# Altium project bdcmc-24.PrjPcb
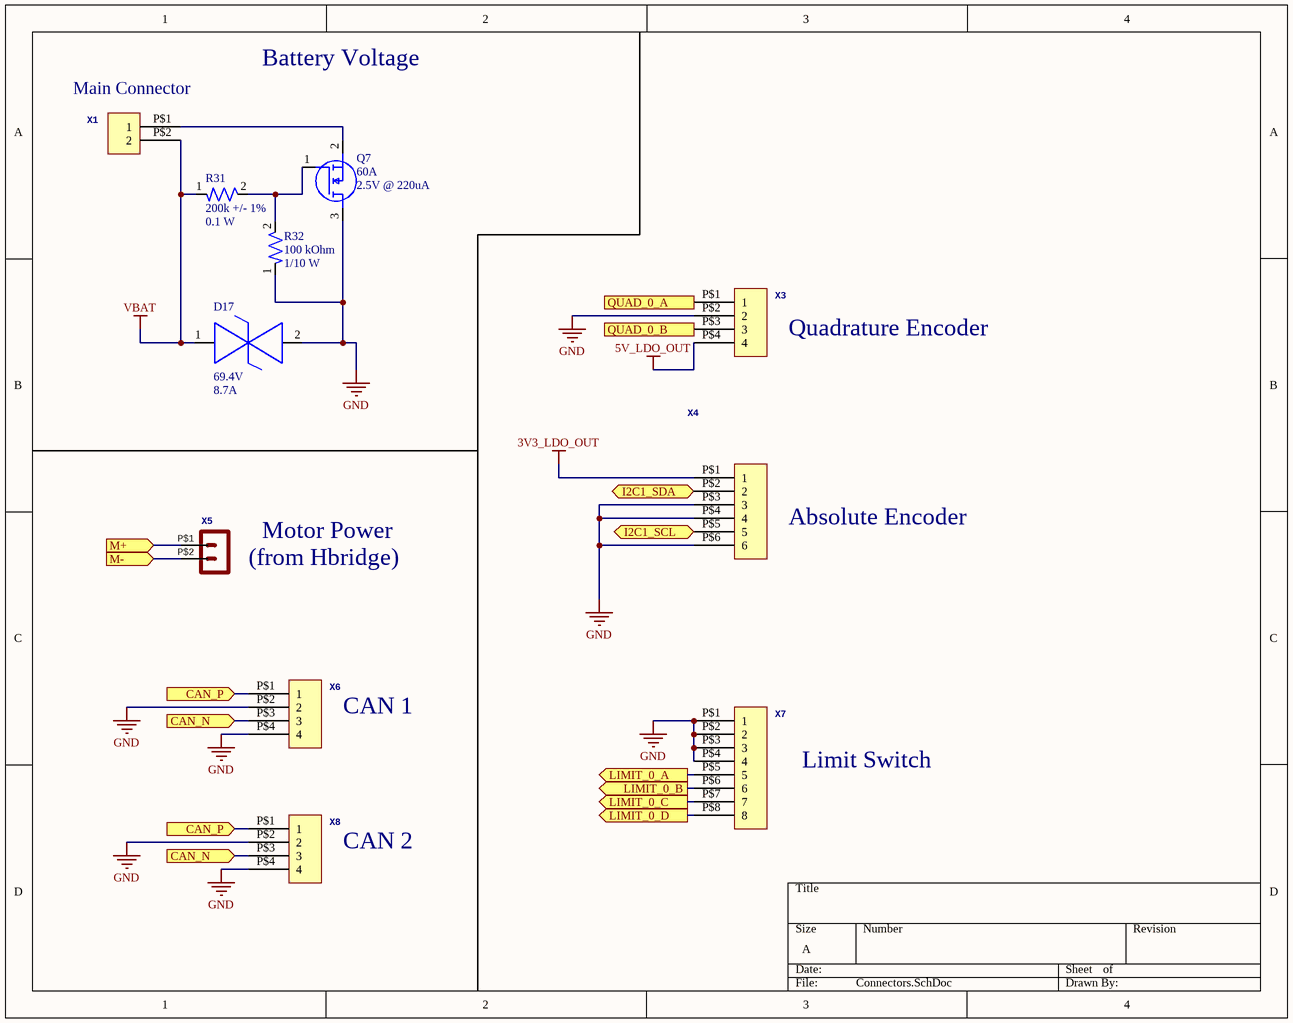
[diagram p0: Connectors.SchDoc]
5 sheets, 114 parts. Net scope: flat (ports and power ports of the same name join across sheets).
Board file: BDCMC_PCB.PcbDoc
Sheets:
  Connectors.SchDoc
  Motor_12V_Buck.SchDoc
  HBridge_Top_Level.SchDoc
  HBridge_Design.SchDoc
  MCU_CAN.SchDoc

## Sheet Connectors.SchDoc
size A; SheetNumber: 1; SheetTotal: 5

### Parts
D17  Vclamp: 69.4V  Peak pulser current: 8.7A  [DO-214AA (SMBJ)]  (hidden comment: SMBJE43CAH)
Q7  Drain Current: 60A  Vgs: 2.5V @ 220uA  [NMOS-8PowerVDFN]  (hidden comment: TPH7R006PL,L1Q)
R31  Resistance: 200k +/- 1%  Power Rating: 0.1 W  [RES-0603]  (hidden comment: ERJ-3EKF2003V)
R32  Resistance: 100 kOhm  Power: 1/10 W  [RES-0603]  (hidden comment: RC0603FR-07100KL)
X1  Molex 43650-0215  [43650-0215]  (value not drawn)
X3  Molex 43045-0412  [43045-0412]  (value not drawn)
X4  Molex 43045-0612  [43045-0612]  (value not drawn)
X5  Molex - Micro-Fit 3.0 Series connector,  3.00mm (0.118") pitch header, 2 positions.  [43045-0212]  (value not drawn)
X6  Molex 43045-0412  [43045-0412]  (value not drawn)
X7  Molex 43045-0812  [43045-0812]  (value not drawn)
X8  Molex 43045-0412  [43045-0412]  (value not drawn)

### Ports
CAN_N (in, see Connectors[1C], MCU_CAN[6B]), CAN_N (in, see Connectors[1D], MCU_CAN[6B]), CAN_P (in, see Connectors[1C], MCU_CAN[6A]), CAN_P (in, see Connectors[1D], MCU_CAN[6A]), I2C1_SCL (bidir, see MCU_CAN[3B]), I2C1_SDA (bidir, see MCU_CAN[3B]), LIMIT_0_A (out, see MCU_CAN[2C]), LIMIT_0_B (out, see MCU_CAN[2C]), LIMIT_0_C (out, see MCU_CAN[2C]), LIMIT_0_D (out, see MCU_CAN[2C]), M+ (in, see HBridge_Design[2B]), M- (in, see HBridge_Design[2B]), QUAD_0_A (out, see MCU_CAN[3B]), QUAD_0_B (out, see MCU_CAN[3B])

### Nets
3V3_LDO_OUT: X4.P$1(1)  [project net VBAT_MCU]
5V_LDO_OUT: X3.P$4(4)  [project net 5V]
GND: D17.2 Q7.3(D) R32.1 X3.P$2(2) X4.P$3(3) X4.P$4(4) X4.P$6(6) X6.P$2(2) X6.P$4(4) X7.P$1(1) X7.P$2(2) X7.P$3(3) X7.P$4(4) X8.P$2(2) X8.P$4(4)
VBAT: D17.1 R31.1 X1.P$2(2)
CAN_N: X6.P$3(3) X8.P$3(3) ; port CAN_N
CAN_P: X6.P$1(1) X8.P$1(1) ; port CAN_P
I2C1_SCL: X4.P$5(5) ; port I2C1_SCL
I2C1_SDA: X4.P$2(2) ; port I2C1_SDA
LIMIT_0_A: X7.P$5(5) ; port LIMIT_0_A
LIMIT_0_B: X7.P$6(6) ; port LIMIT_0_B
LIMIT_0_C: X7.P$7(7) ; port LIMIT_0_C
LIMIT_0_D: X7.P$8(8) ; port LIMIT_0_D
M+: X5.P$1 ; port M+
M-: X5.P$2 ; port M-
QUAD_0_A: X3.P$1(1) ; port QUAD_0_A
QUAD_0_B: X3.P$3(3) ; port QUAD_0_B
NetQ7_1: Q7.1(G) R31.2 R32.2
NetQ7_2: Q7.2(S) X1.P$1(1)

### Notes on the sheet
- (near X1) Main Connector
- Battery Voltage
- Quadrature Encoder
- (near X5) (from Hbridge)
- Motor Power
- Absolute Encoder
- CAN 1
- Limit Switch
- CAN 2

### Library data of the parts
D17 = DIO-69.4V-0001: 69.4V Clamp 8.7A Ipp Tvs Diode Surface Mount DO-214AA (SMBJ); Channels: Bidirectional; Breakdown VOltage: 47.8V; Reverse working maximum voltage: 43V; Package: DO-214AA (SMBJ)
Q7 = NMOS-60A-0001: N-Channel 60 V 60A (Tc) 81W (Tc) Surface Mount 8-SOP Advance (5x5); Vdss: 60V; Vgs(Max): 20V; Package: 8-PowerVDFN
R31 = RES-200K-0001: 200 kOhms ±1% 0.1W, 1/10W Chip Resistor 0603 (1608 Metric) Automotive AEC-Q200 Thick Film; Manufacturer: Panasonic Electronic Components; Assembled?: Yes; MFP: ERJ-3EKF2003V; Package SIze: 0603
R32 = RES-100K-0003: 100 kOhms ±1% 0.1W, 1/10W Chip Resistor 0603 (1608 Metric) Moisture Resistant Thick Film; Tolerance: +/- 1%; Assembled?: No; Package Size: 0603
X1 = Micro-Fit Molex 2 Pin Vertical: GateName_1: G$1; SymbolName_1: HEADER_POS2; DeviceSetName: HEADER_POS2_?; DeviceName: 43650-0215; LibraryName: con-molex-micro-fit-3_0_2; Package: 43650-0215
X3 X6 X8 = Micro-Fit Molex 4 Pin 2 Row Vertical: GateName_1: G$1; SymbolName_1: HEADER_POS4; DeviceSetName: HEADER_POS4_?; DeviceName: 43045-0412; LibraryName: con-molex-micro-fit-3_0_2; Package: 43045-0412
X4 = Micro-Fit Molex 6 Pin 2 Row Vertical: GateName_1: G$1; SymbolName_1: HEADER_POS6; DeviceSetName: HEADER_POS6_?; DeviceName: 43045-0612; LibraryName: con-molex-micro-fit-3_0_2; Package: 43045-0612
X5 = HEADER_POS2_?43045-0212: GateName_1: G$1; SymbolName_1: HEADER_POS2; DeviceName: 43045-0212; LibraryName: con-molex-micro-fit-3_0_2; DeviceSetName: HEADER_POS2_?; Package: 43045-0212
X7 = Micro-Fit Molex 8 Pin 2 Row Vertical: GateName_1: G$1; SymbolName_1: HEADER_POS8; DeviceSetName: HEADER_POS8_?; DeviceName: 43045-0812; LibraryName: con-molex-micro-fit-3_0_2; Package: 43045-0812

## Sheet Motor_12V_Buck.SchDoc
size A; SheetNumber: 2; SheetTotal: 5
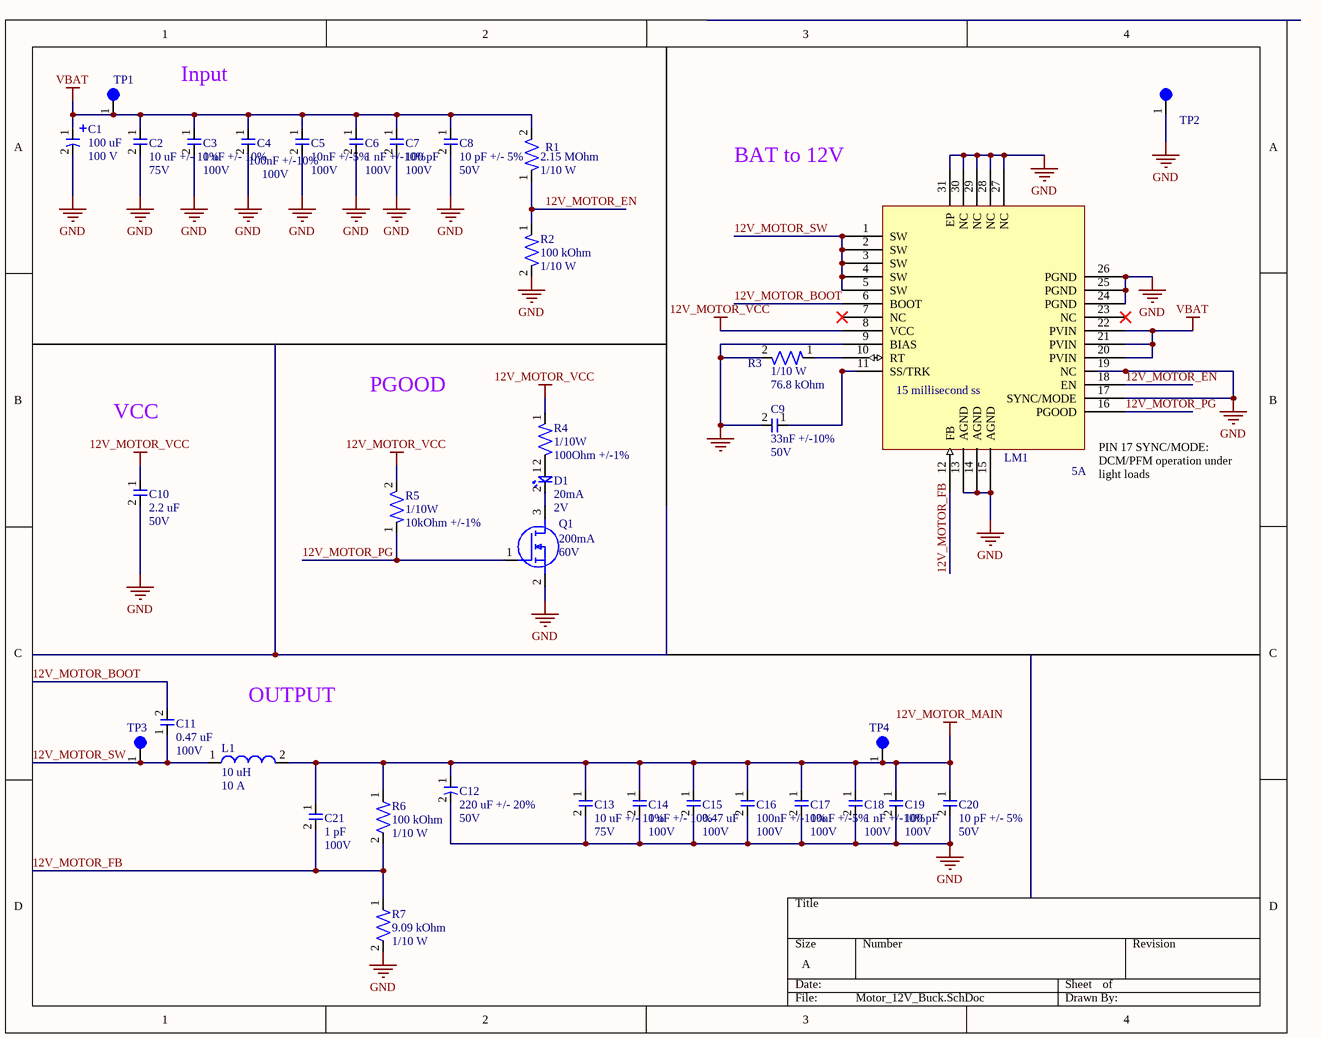
[diagram p1: Motor_12V_Buck.SchDoc]

### Parts
C1  Capacitance: 100 uF  Voltage: 100 V  [ELEC-100U-0001]  (hidden comment: 100SEV100M12.5X16)
C2  Capacitance: 10 uF +/- 10%  Voltage Rating: 75V  [CAP-1210]  (hidden comment: C3225X7R1N106K250AC)
C3  Capacitance: 1 uF +/- 10%  Voltage: 100V  [CAP-1206 - duplicate]  (hidden comment: CL31B105KCHNNNE)
C4  Capacitance: 100nF +/-10%  Voltage Rating: 100V  [CAP-0603]  (hidden comment: CC0603KRX7R0BB104)
C5  Capacitance: 10nF +/-5%  Voltage Rating: 100V  [CAP-0603]  (hidden comment: C1608C0G2A103J080AC)
C6  Capacitance: 1 nF +/-10%  Voltage: 100V  [CAP-0603]  (hidden comment: C0603Y102K1RAC7867)
C7  Capacitance: 100 pF  Voltage: 100V  [CAP-0603]  (hidden comment: 0603N101J101CT)
C8  Capacitance: 10 pF +/- 5%  Voltage Rating: 50V  [CAP-0603]  (hidden comment: 0603N100J500CT)
C9  Capacitance: 33nF +/-10%  Voltage Rating: 50V  [CAP-0603]  (hidden comment: CC0603KRX7R9BB333)
C10  Capacitance: 2.2 uF  oltage: 50V  [CAP-0603]  (hidden comment: UMK107BBJ225KA-T)
C11  Capacitance: 0.47 uF  Voltage: 100V  [CAP-0805]  (hidden comment: KAM21KR72A474KL)
C12  Capacitance: 220 uF +/- 20%  Voltage Rating: 50V  [ELEC-220U-0003]  (hidden comment: 50TZV220M10X10.5)
C13  Capacitance: 10 uF +/- 10%  Voltage Rating: 75V  [CAP-1210]  (hidden comment: C3225X7R1N106K250AC)
C14  Capacitance: 1 uF +/- 10%  Voltage: 100V  [CAP-1206 - duplicate]  (hidden comment: CL31B105KCHNNNE)
C15  Capacitance: 0.47 uF  Voltage: 100V  [CAP-0805]  (hidden comment: KAM21KR72A474KL)
C16  Capacitance: 100nF +/-10%  Voltage Rating: 100V  [CAP-0603]  (hidden comment: CC0603KRX7R0BB104)
C17  Capacitance: 10nF +/-5%  Voltage Rating: 100V  [CAP-0603]  (hidden comment: C1608C0G2A103J080AC)
C18  Capacitance: 1 nF +/-10%  Voltage: 100V  [CAP-0603]  (hidden comment: C0603Y102K1RAC7867)
C19  Capacitance: 100 pF  Voltage: 100V  [CAP-0603]  (hidden comment: 0603N101J101CT)
C20  Capacitance: 10 pF +/- 5%  Voltage Rating: 50V  [CAP-0603]  (hidden comment: 0603N100J500CT)
C21  Capacitance: 1 pF  Voltage: 100V  [CAP-0603]  (hidden comment: 885012006087)
D1  Current Rating: 20mA  Vf: 2V  [LED-0603]  (hidden comment: 150060AS75000)
L1  Inductance: 10 uH  DCI: 10 A  [PWRIND-10U-0002]  (hidden comment: SRP1270-100M)
LM1  Current: 5A  [IC-30-WQFN(6x4)]  (hidden comment: LM76005RNPR)
Q1  Id-Continuous: 200mA  VDS-Max: 60V  [NMOS-SOT23-3]  (hidden comment: T2N7002AK,LM)
R1  Resistance: 2.15 MOhm  Power: 1/10 W  [RES-0603]  (hidden comment: RC0603FR-072M15L)
R2  Resistance: 100 kOhm  Power: 1/10 W  [RES-0603]  (hidden comment: RC0603FR-07100KL)
R3  Power: 1/10 W  Resistance: 76.8 kOhm  [RES-0603]  (hidden comment: RC0603FR-0776K8L)
R4  Power Rating: 1/10W  Resistance: 100Ohm +/-1%  [RES-0603]  (hidden comment: AC0603FR-10100RL)
R5  Power Rating: 1/10W  Resistance: 10kOhm +/-1%  [RES-0603]  (hidden comment: RC0603FR-0710KP)
R6  Resistance: 100 kOhm  Power: 1/10 W  [RES-0603]  (hidden comment: RC0603FR-07100KL)
R7  Resistance: 9.09 kOhm  Power: 1/10 W  [RES-0603]  (hidden comment: RC0603FR-079K09L)
TP1  5003  [TEST-POINT-0001]  (value not drawn)
TP2  5003  [TEST-POINT-0001]  (value not drawn)
TP3  5003  [TEST-POINT-0001]  (value not drawn)
TP4  5003  [TEST-POINT-0001]  (value not drawn)

### Nets
12V_MOTOR_MAIN: C12.1 C13.1 C14.1 C15.1 C16.1 C17.1 C18.1 C19.1 C20.1 C21.1 L1.2 R6.1 TP4.1
12V_MOTOR_VCC: C10.1 LM1.8(VCC) R4.1 R5.2
GND: C1.2 C2.2 C3.2 C4.2 C5.2 C6.2 C7.2 C8.2 C10.2 C12.2 C13.2 C14.2 C15.2 C16.2 C17.2 C18.2 C19.2 C20.2 LM1.13(AGND) LM1.14(AGND) LM1.15(AGND) LM1.17(SYNC/MODE) LM1.19(NC) LM1.24(PGND) LM1.25(PGND) LM1.26(PGND) LM1.27(NC) LM1.28(NC) LM1.29(NC) LM1.30(NC) LM1.31(EP) Q1.2(S) R2.2 R7.2 TP2.1
NetC9_2: C9.2 LM1.9(BIAS) R3.2
VBAT: C1.1 C2.1 C3.1 C4.1 C5.1 C6.1 C7.1 C8.1 LM1.20(PVIN) LM1.21(PVIN) LM1.22(PVIN) R1.2 TP1.1
12V_MOTOR_BOOT: C11.2 LM1.6(BOOT)
12V_MOTOR_EN: LM1.18(EN) R1.1 R2.1
12V_MOTOR_FB: C21.2 LM1.12(FB) R6.2 R7.1
12V_MOTOR_PG: LM1.16(PGOOD) Q1.1(G) R5.1
12V_MOTOR_SW: C11.1 L1.1 LM1.1(SW) LM1.2(SW) LM1.3(SW) LM1.4(SW) LM1.5(SW) TP3.1
NetC9_1: C9.1 LM1.11(SS/TRK)
NetD1_1: D1.1 R4.2
NetD1_2: D1.2 Q1.3(D)
NetLM1_10: LM1.10(RT) R3.1

Not connected (* = marked no-connect by the designer): LM1 7(NC)* 23(NC)*

### Notes on the sheet
- Input
- (near LM1) BAT to 12V
- VCC
- PGOOD
- (near LM1) 15 millisecond ss
- (near LM1) PIN 17 SYNC/MODE: DCM/PFM operation under light loads
- OUTPUT

### Library data of the parts
C1 = ELEC-100U-0001: 100 µF 100 V Aluminum Electrolytic Capacitors Radial, Can - SMD 2000 Hrs @ 85°C; Manufacturer: Rubycon; Tolerance: +/- 20%; Assembled?: No; ESR: idk check the datasheet i couldnt find it
C2 C13 = CAP-10U-0004: 10 µF ±10% 75V Ceramic Capacitor X7R 1210 (3225 Metric)
C3 C14 = CAP-1U-0001: 1 µF ±10% 100V Ceramic Capacitor X7R 1206 (3216 Metric)
C4 C16 = CAP-100N-0001: CAP CER 0.1UF 100V X7R 0603; Manufacturer: YAGEO; Assembled?: no; Manufacturer Part Number: CC0603KRX7R0BB104; Temperature Coefficient: X7R; Package Size: 0603
C5 C17 = CAP-10N-0002: CAP CER 10000PF 100V C0G 0603; Manufacturer: TDK Corporation; Temperature Coefficient: C0G/NP0; Assembled?: no; Manufacturer Part Number: C1608C0G2A103J080AC; Package Size: 0603
C6 C18 = CAP-1N-0001: 1000 pF ±10% 100V Ceramic Capacitor X7R 0603 (1608 Metric)
C7 C19 = CAP-100P-0002: 100 pF ±5% 100V Ceramic Capacitor C0G, NP0 0603 (1608 Metric); Tolerance: +/-5%; Temp Coeff: C0G/NP0; Package Size: 0603
C8 C20 = CAP-10P-0001: 10 pF ±5% 50V Ceramic Capacitor C0G, NP0 0603 (1608 Metric); Manufacturer: Walshin Technology Corporation; Assembled?: Yes; Manufacturer Part Number: 0603N100J500CT; Temperature Coefficient: C0G, NP0; Package Size: 0603
C9 = CAP-33N-0001: 0.033 µF ±10% 50V Ceramic Capacitor X7R 0603 (1608 Metric); Manufacturer: YAGEO; Assembled?: no; Manufacturer Part Number: CC0603KRX7R9BB333; Temperature Coefficient: X7R; Package Size: 0603
C10 = CAP-2.2U-0001: 2.2 µF ±10% 50V Ceramic Capacitor X5R 0603 (1608 Metric)
C11 C15 = CAP-0.47U-0001: 0.47 µF ±10% 100V Ceramic Capacitor X7R 0805 (2012 Metric); Tolerance: +/- 10%; Assembled?: No; Temperature Coefficient: X7R; Package Size: 0805
C12 = ELEC-220U-0003: 220 µF 50 V Aluminum Electrolytic Capacitors Radial, Can - SMD 2000 Hrs @ 105°C; Size: .406inx.406in*.413in
C21 = CAP-1P-0001: 1 pF ±0.25pF 100V Ceramic Capacitor C0G, NP0 0603 (1608 Metric); Tolerance: +/- 0.25 pF; Temperature Coefficient: C0G/NP0; Assembled?: No; Package Size: 0603
D1 = LED_Amber_0001: CAP CER 0.1UF 100V X7R 0603; Manufacturer: Wurth Electronik; Assembled?: no; Color: Amber; Manufacturer Part Number: 150060AS75000; Package Size: 0603
L1 = PWRIND-10U-0002: 10 µH Shielded Drum Core, Wirewound Inductor 10 A 16.8mOhm Max Nonstandard; Tolerance: +/- 20%; Isat: 16A; Assembled?: No; DCR: 16.8 mOhm
LM1 = IC-BUCK-0006: Buck Switching Regulator IC Positive Adjustable 1V 1 Output 5A 30-WFQFN Exposed Pad; Manufacturer: Texas Instruments; Assembled?: no; Manufacturer Part Number: LM76005RNPR; Type: Buck; Package: 30-WFQFN
Q1 = NMOS-200MA-0001: MOSFET N-CH 60V 200MA SOT23; Manufacturer: Toshiba; FET type: N-Channel; Rds On-Max: 3.9Ohm; Vgs-Max: 20V; Assembled?: no; Manufacturer Part Number: T2N7002AK,LM; Package: SOT-23-3
R1 = RES-2.15M-0001: 2.15 MOhms ±1% 0.1W, 1/10W Chip Resistor 0603 (1608 Metric) Moisture Resistant Thick Film; Tolerance: +/-1%; Assembled?: No; Package Size: 0603
R2 R6 = RES-100K-0003: as R32 on sheet Connectors; Package Size: 0603
R3 = RES-76.8K-0001: 76.8 kOhms ±1% 0.1W, 1/10W Chip Resistor 0603 (1608 Metric) Moisture Resistant Thick Film; Manufacturer: Yageo; Tolerance: +/- 1%; Package Size: 0603
R4 = RES-100-0002: 100 Ohms ±1% 0.1W, 1/10W Chip Resistor 0603 (1608 Metric) Automotive AEC-Q200 Thick Film; Manufacturer: YAGEO; Assembled?: no; Manufacturer Part Number: AC0603FR-10100RL; Package Size: 0603
R5 = RES-10K-0002: RES SMD 10K OHM 1% 1/10W 0603; Manufacturer: YAGEO; Assembled?: no; Manufacturer Part Number: RC0603FR-0710KP; Package Size: 0603
R7 = RES-9.09K-0001: 9.09 kOhms ±1% 0.1W, 1/10W Chip Resistor 0603 (1608 Metric) Moisture Resistant Thick Film; Tolerance: +/-1%; Assembled?: No; Package Size: 0603
TP1-TP4 = TEST-POINT-0001: Oranange PC Test Point, Miniature Phoisphor Bronze Silver Plating Through Hole Mounting Type

## Sheet HBridge_Top_Level.SchDoc
size 203 x 127 mm; SheetNumber: 4; SheetTotal: 6
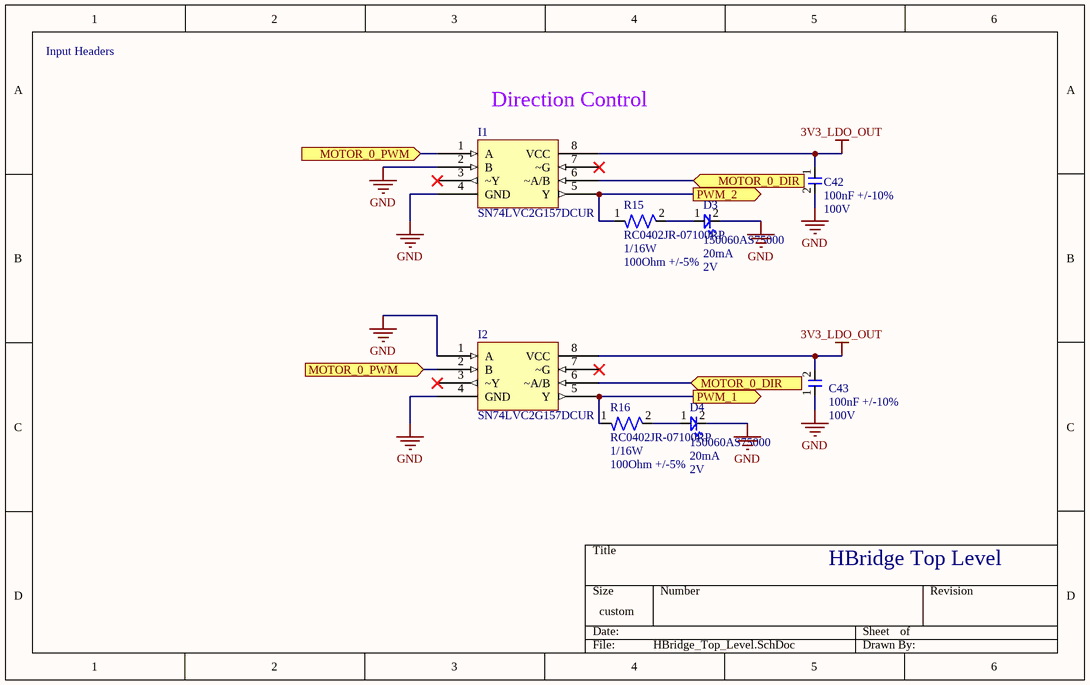
[diagram p2: HBridge_Top_Level.SchDoc]

### Parts
C42  Capacitance: 100nF +/-10%  Voltage Rating: 100V  [CAP-0603]  (hidden comment: CC0603KRX7R0BB104)
C43  Capacitance: 100nF +/-10%  Voltage Rating: 100V  [CAP-0603]  (hidden comment: CC0603KRX7R0BB104)
D3  150060AS75000  Current Rating: 20mA  Vf: 2V  [LED-0603]
D4  150060AS75000  Current Rating: 20mA  Vf: 2V  [LED-0603]
I1  SN74LVC2G157DCUR  [IC-MUX-8VSSOP]
I2  SN74LVC2G157DCUR  [IC-MUX-8VSSOP]
R15  RC0402JR-07100RP  Power Rating: 1/16W  Resistance: 100Ohm +/-5%  [RES-0402]
R16  RC0402JR-07100RP  Power Rating: 1/16W  Resistance: 100Ohm +/-5%  [RES-0402]

### Ports
MOTOR_0_DIR (in, see HBridge_Top_Level[4B], MCU_CAN[4C]), MOTOR_0_DIR (in, see HBridge_Top_Level[4C], MCU_CAN[4C]), MOTOR_0_PWM (in, see HBridge_Top_Level[2A], MCU_CAN[4C]), MOTOR_0_PWM (in, see HBridge_Top_Level[2C], MCU_CAN[4C]), PWM_1 (out, see HBridge_Design[1D]), PWM_2 (out, see HBridge_Design[1D])

### Nets
3V3_LDO_OUT: C42.1 C43.2 I1.8(VCC) I2.8(VCC)  [project net VBAT_MCU]
GND: C42.2 C43.1 D3.2 D4.2 I1.2(B) I1.4(GND) I2.1(A) I2.4(GND)
DIR_1_In: I2.5(Y) R16.1 ; port PWM_1
DIR_2_In: I1.5(Y) R15.1 ; port PWM_2
MOTOR_0_DIR: I1.6(~A/B) I2.6(~A/B) ; port MOTOR_0_DIR
MOTOR_0_PWM: I1.1(A) I2.2(B) ; port MOTOR_0_PWM
NetD3_1: D3.1 R15.2
NetD4_1: D4.1 R16.2

Not connected (* = marked no-connect by the designer): I1 3(~Y)* 7(~G)*; I2 3(~Y)* 7(~G)*

### Notes on the sheet
- Input Headers
- (near I1) Direction Control
- HBridge Top Level

### Library data of the parts
C42 C43 = CAP-100N-0001: as C4 on sheet Motor_12V_Buck; Manufacturer Part Number: CC0603KRX7R0BB104; Temperature Coefficient: X7R; Package Size: 0603
D3 D4 = LED_Amber_0001: as D1 on sheet Motor_12V_Buck; Manufacturer Part Number: 150060AS75000; Package Size: 0603
I1 = IC-MUX-0001
I2 = IC-MUX-0001: Multiplexer 1 x 2:1 8-VSSOP; Vin: 1.65-5.5V
R15 R16 = RES-100-0001: RES SMD 100 OHM 5% 1/16W 0402; Manufacturer: YAGEO; Assembled?: no; Manufacturer Part Number: RC0402JR-07100RP; Package Size: 0402

## Sheet HBridge_Design.SchDoc
size Letter; SheetNumber: 4; SheetTotal: 5
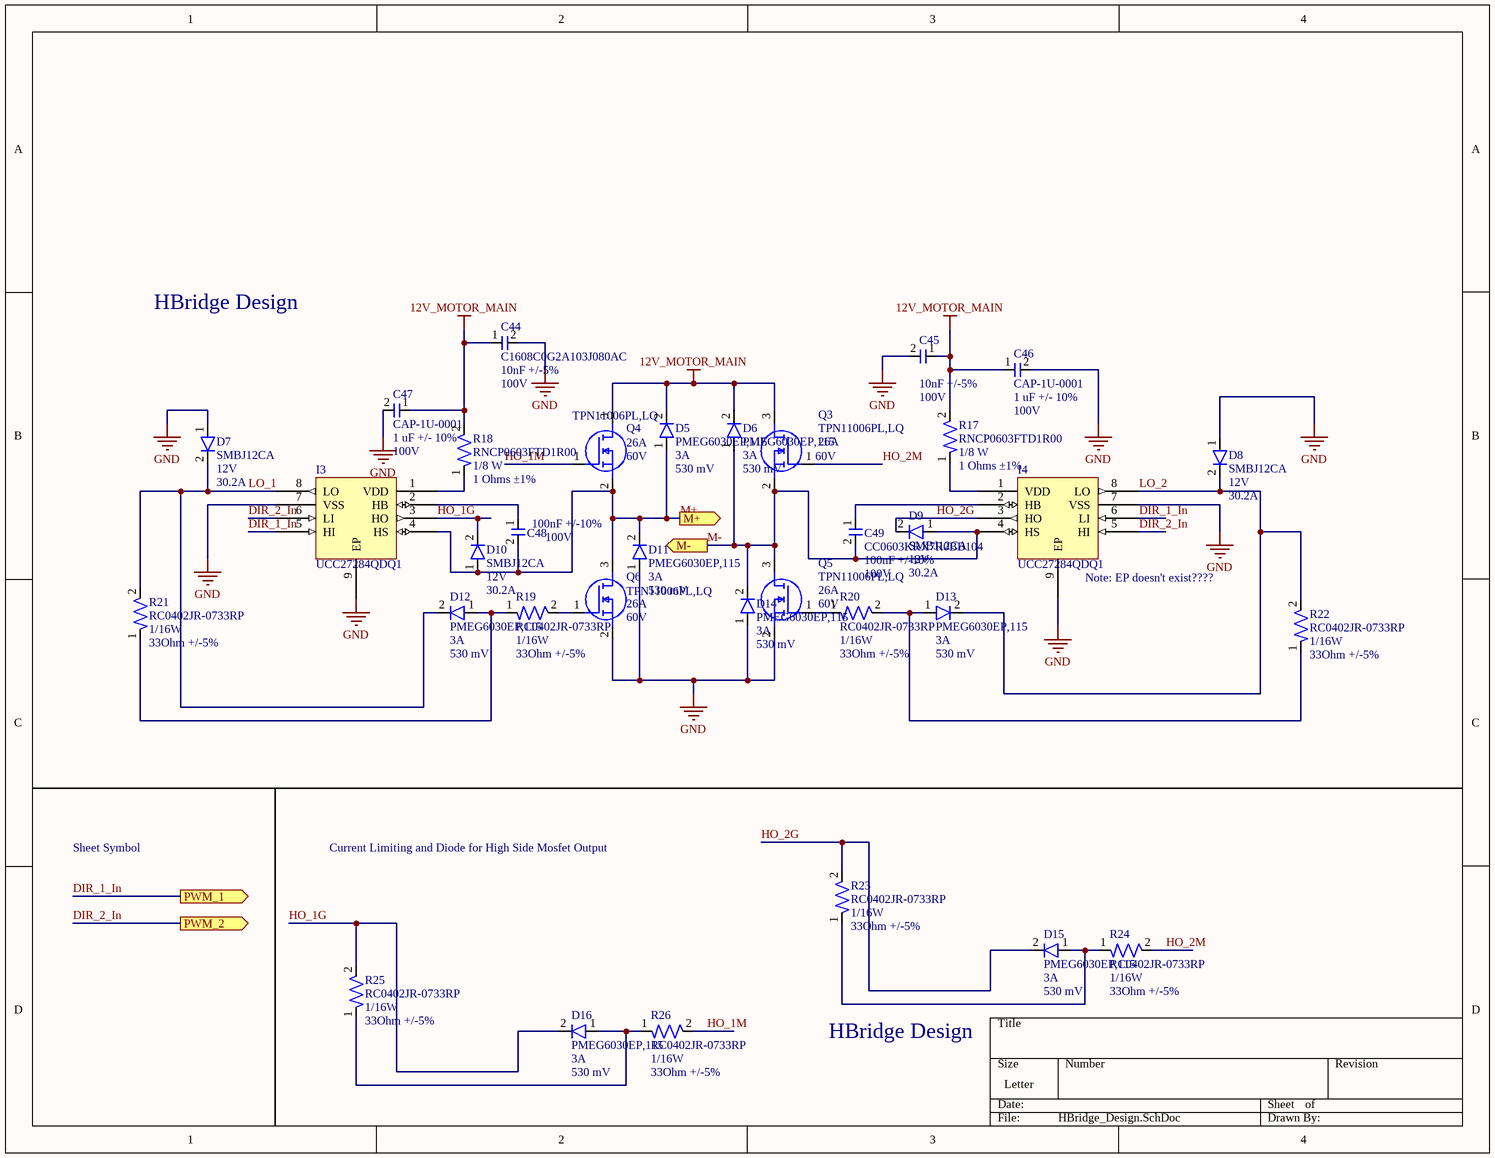
[diagram p3: HBridge_Design.SchDoc]

### Parts
C44  C1608C0G2A103J080AC  Capacitance: 10nF +/-5%  Voltage Rating: 100V  [CAP-0603]
C45  Capacitance: 10nF +/-5%  Voltage Rating: 100V  [CAP-0603]  (hidden comment: C1608C0G2A103J080AC)
C46  CAP-1U-0001  Capacitance: 1 uF +/- 10%  Voltage: 100V  [CAP-1206 - duplicate]
C47  CAP-1U-0001  Capacitance: 1 uF +/- 10%  Voltage: 100V  [CAP-1206 - duplicate]
C48  Capacitance: 100nF +/-10%  Voltage Rating: 100V  [CAP-0603]  (hidden comment: CC0603KRX7R0BB104)
C49  CC0603KRX7R0BB104  Capacitance: 100nF +/-10%  Voltage Rating: 100V  [CAP-0603]
D5  PMEG6030EP,115  Current Rating: 3A  Vf (Voltage Forward): 530 mV  [DIO-SOD128]
D6  PMEG6030EP,115  Current Rating: 3A  Vf (Voltage Forward): 530 mV  [DIO-SOD128]
D7  SMBJ12CA  Standoff Voltage: 12V  Current Rating: 30.2A  [DO-214AA (SMBJ)]
D8  SMBJ12CA  Standoff Voltage: 12V  Current Rating: 30.2A  [DO-214AA (SMBJ)]
D9  SMBJ12CA  Standoff Voltage: 12V  Current Rating: 30.2A  [DO-214AA (SMBJ)]
D10  SMBJ12CA  Standoff Voltage: 12V  Current Rating: 30.2A  [DO-214AA (SMBJ)]
D11  PMEG6030EP,115  Current Rating: 3A  Vf (Voltage Forward): 530 mV  [DIO-SOD128]
D12  PMEG6030EP,115  Current Rating: 3A  Vf (Voltage Forward): 530 mV  [DIO-SOD128]
D13  PMEG6030EP,115  Current Rating: 3A  Vf (Voltage Forward): 530 mV  [DIO-SOD128]
D14  PMEG6030EP,115  Current Rating: 3A  Vf (Voltage Forward): 530 mV  [DIO-SOD128]
D15  PMEG6030EP,115  Current Rating: 3A  Vf (Voltage Forward): 530 mV  [DIO-SOD128]
D16  PMEG6030EP,115  Current Rating: 3A  Vf (Voltage Forward): 530 mV  [DIO-SOD128]
I3  UCC27284QDQ1  [IC-BUCK-8SOIC]
I4  UCC27284QDQ1  [IC-BUCK-8SOIC]
Q3  TPN11006PL,LQ  Id-Continuous: 26A  VDS-Max: 60V  [NMOS-8TSON]
Q4  TPN11006PL,LQ  Id-Continuous: 26A  VDS-Max: 60V  [NMOS-8TSON]
Q5  TPN11006PL,LQ  Id-Continuous: 26A  VDS-Max: 60V  [NMOS-8TSON]
Q6  TPN11006PL,LQ  Id-Continuous: 26A  VDS-Max: 60V  [NMOS-8TSON]
R17  RNCP0603FTD1R00  Power: 1/8 W  Resistance: 1 Ohms ±1%  [RES-0603]
R18  RNCP0603FTD1R00  Power: 1/8 W  Resistance: 1 Ohms ±1%  [RES-0603]
R19  RC0402JR-0733RP  Power Rating: 1/16W  Resistance: 33Ohm +/-5%  [RES-0402]
R20  RC0402JR-0733RP  Power Rating: 1/16W  Resistance: 33Ohm +/-5%  [RES-0402]
R21  RC0402JR-0733RP  Power Rating: 1/16W  Resistance: 33Ohm +/-5%  [RES-0402]
R22  RC0402JR-0733RP  Power Rating: 1/16W  Resistance: 33Ohm +/-5%  [RES-0402]
R23  RC0402JR-0733RP  Power Rating: 1/16W  Resistance: 33Ohm +/-5%  [RES-0402]
R24  RC0402JR-0733RP  Power Rating: 1/16W  Resistance: 33Ohm +/-5%  [RES-0402]
R25  RC0402JR-0733RP  Power Rating: 1/16W  Resistance: 33Ohm +/-5%  [RES-0402]
R26  RC0402JR-0733RP  Power Rating: 1/16W  Resistance: 33Ohm +/-5%  [RES-0402]

### Ports
M+ (out, see Connectors[1C]), M- (out, see Connectors[1C]), PWM_1 (out, see HBridge_Top_Level[4C]), PWM_2 (out, see HBridge_Top_Level[4B])

### Nets
12V_MOTOR_MAIN: C44.1 C45.1 C46.1 C47.1 D5.2 D6.2 Q3.3(D) Q4.3(D) R17.2 R18.2
GND: C44.2 C45.2 C46.2 C47.2 D7.1 D8.1 D11.1 D14.1 I3.7(VSS) I3.9(EP) I4.7(VSS) I4.9(EP) Q5.2(S) Q6.2(S)
DIR_1_In: I3.5(HI) I4.6(LI) ; port PWM_1
DIR_2_In: I3.6(LI) I4.5(HI) ; port PWM_2
HO_1G: D10.2 D16.2 I3.3(HO) R25.2
HO_1M: Q4.1(G) R26.2
HO_2G: D9.2 D15.2 I4.3(HO) R23.2
HO_2M: Q3.1(G) R24.2
LO_1: D7.2 D12.2 I3.8(LO) R21.2
LO_2: D8.2 D13.2 I4.8(LO) R22.2
M+: C48.2 D5.1 D10.1 D11.2 I3.4(HS) Q4.2(S) Q6.3(D) ; port M+
M-: C49.2 D6.1 D9.1 D14.2 I4.4(HS) Q3.2(S) Q5.3(D) ; port M-
NetC48_1: C48.1 I3.2(HB)
NetC49_1: C49.1 I4.2(HB)
NetD12_1: D12.1 R19.1 R21.1
NetD13_1: D13.1 R20.2 R22.1
NetD15_1: D15.1 R23.1 R24.1
NetD16_1: D16.1 R25.1 R26.1
NetI3_1: I3.1(VDD) R18.1
NetI4_1: I4.1(VDD) R17.1
NetQ5_1: Q5.1(G) R20.1
NetQ6_1: Q6.1(G) R19.2

### Notes on the sheet
- HBridge Design
- (near I4) Note: EP doesn't exist????
- Sheet Symbol
- Current Limiting and Diode for High Side Mosfet Output

### Library data of the parts
C44 C45 = CAP-10N-0002: as C5 on sheet Motor_12V_Buck; Manufacturer Part Number: C1608C0G2A103J080AC; Package Size: 0603
C46 C47 = CAP-1U-0001: as C3 on sheet Motor_12V_Buck
C48 C49 = CAP-100N-0001: as C4 on sheet Motor_12V_Buck; Manufacturer Part Number: CC0603KRX7R0BB104; Temperature Coefficient: X7R; Package Size: 0603
D5 D6 D11-D16 = DIO-0.53V-0001: Diode Schottky 60 V 3A Surface Mount SOD-128/CFP5; Manufacturer: Nexperia USA Inc.; Assembled: no; Manufacturer Part Number: PMEG6030EP,115; Package: SOD-128/CFP5
D7-D10 = DIO-19.9V-0001: 19.9V Clamp 30.2A Ipp Tvs Diode Surface Mount DO-214AA (SMBJ); Manufacturer: Littlefuse Inc.; Assembled: No; Breakdown Voltage: 13.3; Manufacturer Part Number: SMBJ12CA; Package: DO-214AA (SMBJ)
I3 I4 = IC-GDRV-0001: Gate Drivers Automotive 3-A, 120-V half bridge gate driver with 5-V UVLO and enable 8-SOIC -40 to 125; Manufacturer: Texas Instruments; Assembled?: no; VCC-Max: 16V; VCC-Min: 5.5V; Load Voltage-Max: 120V; Supply Current: 3A; Manufacturer Part Number: UCC27284QDQ1; Package: SOIC-8
Q3-Q6 = NMOS-26A-0001: MOSFET N-CH 60V 200MA SOT23; Manufacturer: Toshiba; FET type: N-Channel; Rds On-Max: 18.1mOhm; Vgs-Max: 20V; Assembled?: no; Manufacturer Part Number: TPN11006PL,LQ; Package: 8-TSON Advance
R17 R18 = RES-1-0001: 1 Ohms ±1% 0.125W, 1/8W Chip Resistor 0603 (1608 Metric) Anti-Sulfur Thin Film
R19-R26 = RES-33-0001: RES SMD 33 OHM 5% 1/16W 0402; Manufacturer: YAGEO; Assembled?: no; Manufacturer Part Number: RC0402JR-0733RP; Package Size: 0402

## Sheet MCU_CAN.SchDoc
size B; SheetNumber: 5; SheetTotal: 5
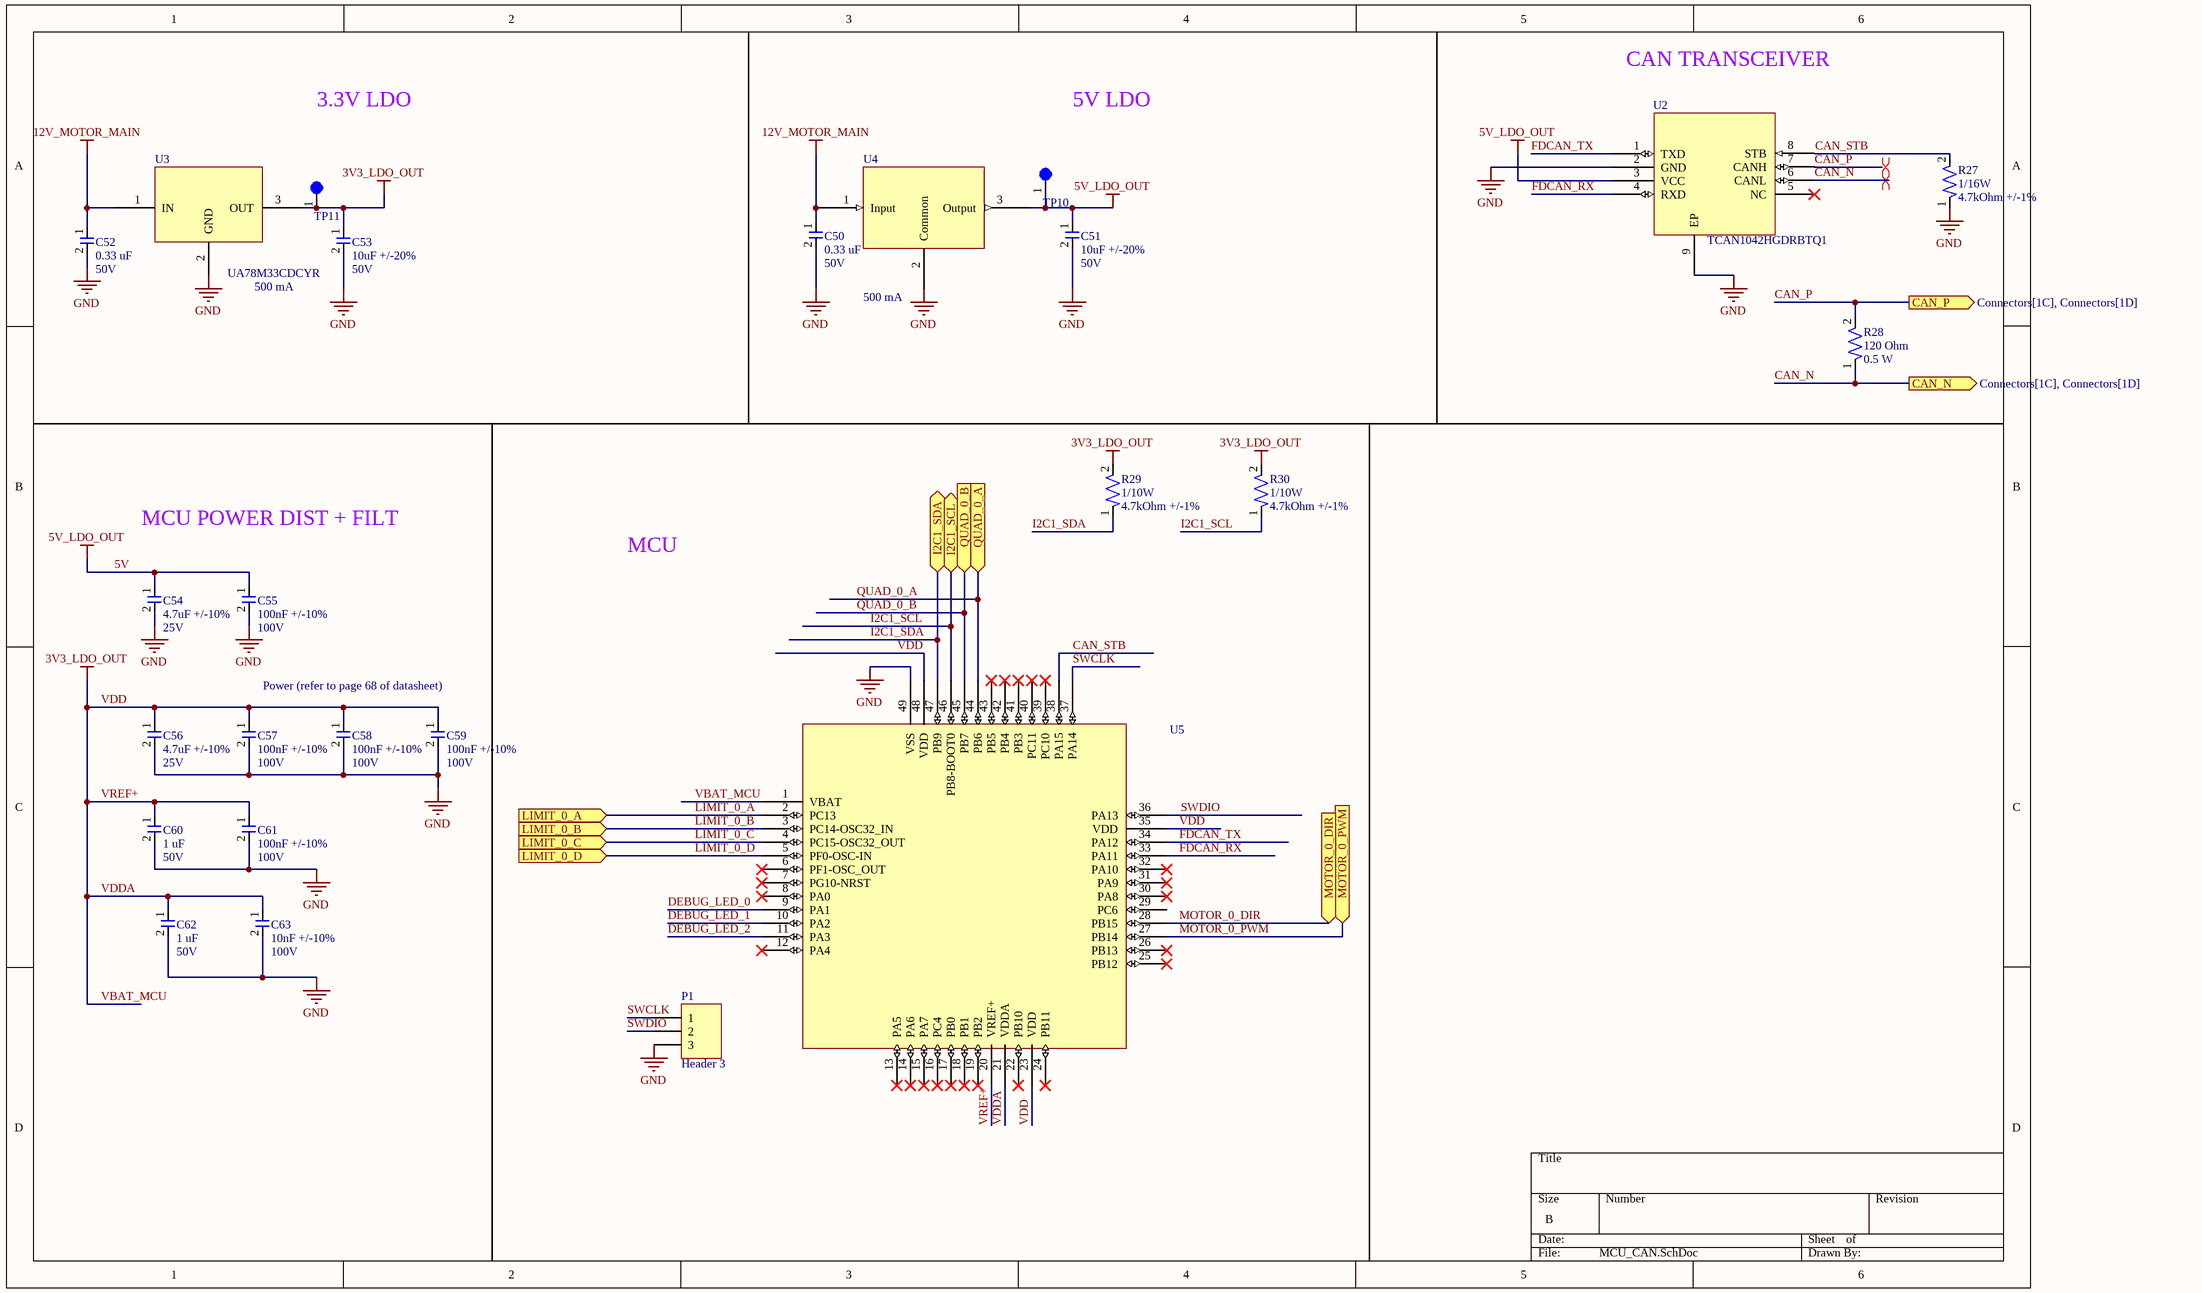
[diagram p4: MCU_CAN.SchDoc]

### Parts
C50  Capacitance: 0.33 uF  Voltage: 50V  [CAP-0603]  (hidden comment: CGA3E3X7R1H334K080AB)
C51  Capacitance: 10uF +/-20%  Voltage Rating: 50V  [CAP-1206]  (hidden comment: CL31B106KBHNNNE)
C52  Capacitance: 0.33 uF  Voltage: 50V  [CAP-0603]  (hidden comment: CGA3E3X7R1H334K080AB)
C53  Capacitance: 10uF +/-20%  Voltage Rating: 50V  [CAP-1206]  (hidden comment: CL31B106KBHNNNE)
C54  Capacitance: 4.7uF +/-10%  Voltage Rating: 25V  [CAP-0603]  (hidden comment: TMK107BBJ475KA-T)
C55  Capacitance: 100nF +/-10%  Voltage Rating: 100V  [CAP-0603]  (hidden comment: CC0603KRX7R0BB104)
C56  Capacitance: 4.7uF +/-10%  Voltage Rating: 25V  [CAP-0603]  (hidden comment: TMK107BBJ475KA-T)
C57  Capacitance: 100nF +/-10%  Voltage Rating: 100V  [CAP-0603]  (hidden comment: CC0603KRX7R0BB104)
C58  Capacitance: 100nF +/-10%  Voltage Rating: 100V  [CAP-0603]  (hidden comment: CC0603KRX7R0BB104)
C59  Capacitance: 100nF +/-10%  Voltage Rating: 100V  [CAP-0603]  (hidden comment: CC0603KRX7R0BB104)
C60  Capacitance: 1 uF  Voltage: 50V  [CAP-0603]  (hidden comment: UMK107AB7105KA-T)
C61  Capacitance: 100nF +/-10%  Voltage Rating: 100V  [CAP-0603]  (hidden comment: CC0603KRX7R0BB104)
C62  Capacitance: 1 uF  Voltage: 50V  [CAP-0603]  (hidden comment: UMK107AB7105KA-T)
C63  Capacitance: 10nF +/-10%  Voltage Rating: 100V  [CAP-0402]  (hidden comment: CC0402KRX7R0BB103)
P1  Header 3  [HDR1X3]
R27  Power Rating: 1/16W  Resistance: 4.7kOhm +/-1%  [RES-0402]  (hidden comment: RC0402FR-074K7P)
R28  Resistance: 120 Ohm  Power: 0.5 W  [RES-1206]  (hidden comment: CRGH1206F120R)
R29  Power Rating: 1/10W  Resistance: 4.7kOhm +/-1%  [RES-0603]  (hidden comment: AF0603FR-074K7L)
R30  Power Rating: 1/10W  Resistance: 4.7kOhm +/-1%  [RES-0603]  (hidden comment: AF0603FR-074K7L)
TP10  5003  [TEST-POINT-0001]  (value not drawn)
TP11  5003  [TEST-POINT-0001]  (value not drawn)
U2  TCAN1042HGDRBTQ1  [IC-8-VSON]
U3  UA78M33CDCYR  Current: 500 mA  [IC-SOT-223-4]
U4  Current: 500 mA  [IC-SOT-223-4]  (hidden comment: UA78M05IDCYR)
U5  STM32G431CBU6  [MCU-UFQFPN48]  (value not drawn)

### Ports
CAN_N (out, see Connectors[1C], Connectors[1D]), CAN_P (out, see Connectors[1C], Connectors[1D]), I2C1_SCL (bidir, see Connectors[2C]), I2C1_SDA (bidir, see Connectors[2B]), LIMIT_0_A (in, see Connectors[2D]), LIMIT_0_B (in, see Connectors[2D]), LIMIT_0_C (in, see Connectors[2D]), LIMIT_0_D (in, see Connectors[2D]), MOTOR_0_DIR (in, see HBridge_Top_Level[4B], HBridge_Top_Level[4C]), MOTOR_0_PWM (in, see HBridge_Top_Level[2A], HBridge_Top_Level[2C]), QUAD_0_A (in, see Connectors[2B]), QUAD_0_B (in, see Connectors[2B])

### Nets
5V: C51.1 C54.1 C55.1 TP10.1 U2.3(VCC) U4.3(Output)  [also labelled 5V_LDO_OUT]
12V_MOTOR_MAIN: C50.1 C52.1 U3.1(IN) U4.1(Input)
GND: C50.2 C51.2 C52.2 C53.2 C54.2 C55.2 C56.2 C57.2 C58.2 C59.2 C60.2 C61.2 C62.2 C63.2 P1.3 R27.1 U2.2(GND) U2.9(EP) U3.2(GND) U4.2(Common) U5.49(VSS)
VBAT_MCU: C53.1 C56.1 C57.1 C58.1 C59.1 C60.1 C61.1 C62.1 C63.1 R29.2 R30.2 TP11.1 U3.3(OUT) U5.1(VBAT) U5.20(VREF+) U5.21(VDDA) U5.23(VDD) U5.35(VDD) U5.48(VDD)  [also labelled 3V3_LDO_OUT, VDD, VDDA, VREF+]
CAN_N: R28.1 U2.6(CANL) ; port CAN_N
CAN_P: R28.2 U2.7(CANH) ; port CAN_P
CAN_STB: R27.2 U2.8(STB) U5.38(PA15)
DEBUG_LED_0: U5.9(PA1)
DEBUG_LED_1: U5.10(PA2)
DEBUG_LED_2: U5.11(PA3)
FDCAN_RX: U2.4(RXD) U5.33(PA11)
FDCAN_TX: U2.1(TXD) U5.34(PA12)
I2C1_SCL: R30.1 U5.46(PB8-BOOT0) ; port I2C1_SCL
I2C1_SDA: R29.1 U5.47(PB9) ; port I2C1_SDA
LIMIT_0_A: U5.2(PC13) ; port LIMIT_0_A
LIMIT_0_B: U5.3(PC14-OSC32_IN) ; port LIMIT_0_B
LIMIT_0_C: U5.4(PC15-OSC32_OUT) ; port LIMIT_0_C
LIMIT_0_D: U5.5(PF0-OSC-IN) ; port LIMIT_0_D
MOTOR_0_DIR: U5.28(PB15) ; port MOTOR_0_DIR
MOTOR_0_PWM: U5.27(PB14) ; port MOTOR_0_PWM
QUAD_0_A: U5.44(PB6) ; port QUAD_0_A
QUAD_0_B: U5.45(PB7) ; port QUAD_0_B
SWCLK: P1.1 U5.37(PA14)
SWDIO: P1.2 U5.36(PA13)

Not connected (* = marked no-connect by the designer): U2 5(NC)*; U5 6(PF1-OSC_OUT)* 7(PG10-NRST)* 8(PA0)* 12(PA4)* 13(PA5)* 14(PA6)* 15(PA7)* 16(PC4)* 17(PB0)* 18(PB1)* 19(PB2)* 22(PB10)* 24(PB11)* 25(PB12)* 26(PB13)* 29(PC6) 30(PA8)* 31(PA9)* 32(PA10)* 39(PC10)* 40(PC11)* 41(PB3)* 42(PB4)* 43(PB5)*

### Layout directives
differential pair: CAN_N, CAN_P

### Notes on the sheet
- CAN TRANSCEIVER
- 3.3V LDO
- 5V LDO
- MCU POWER DIST + FILT
- MCU
- Power (refer to page 68 of datasheet)

### Library data of the parts
C50 C52 = CAP-0.33uF-0001: 0.33 µF ±10% 50V Ceramic Capacitor X7R 0603 (1608 Metric); Manufacturer: TDK Corporation; Tolerance: +/- 10%; Manufacturer Part Number: CGA3E3X7R1H334K080AB; Temperature Coefficient: X7R
C51 C53 = CAP-10U-0001: 10 µF ±10% 50V Ceramic Capacitor X7R 1206 (3216 Metric); Manufacturer: Samsung Electro-Mechanics; Assembled?: no; Manufacturer Part Number: CL31B106KBHNNNE; Temperature Coefficient: X7R; Package Size: 1206
C54 C56 = CAP-4.7U-0001: 4.7 µF ±10% 25V Ceramic Capacitor X5R 0603 (1608 Metric); Manufacturer: Taiyo Yuden; Assembled?: no; Manufacturer Part Number: TMK107BBJ475KA-T; Temperature Coefficient: X5R; Package Size: 0603
C55 C57-C59 C61 = CAP-100N-0001: as C4 on sheet Motor_12V_Buck; Manufacturer Part Number: CC0603KRX7R0BB104; Temperature Coefficient: X7R; Package Size: 0603
C60 C62 = CAP-1U-0002: 1 µF ±10% 50V Ceramic Capacitor X7R 0603 (1608 Metric); Package Size: 0603
C63 = CAP-10N-0001: 10000 pF ±10% 100V Ceramic Capacitor X7R 0402 (1005 Metric); Manufacturer: YAGEO; Assembled?: no; Manufacturer Part Number: CC0402KRX7R0BB103; Temperature Coefficient: X7R; Package Size: 0402
P1 = Header 3: Header, 3-Pin; LatestRevisionDate: 17-Jul-2002; LatestRevisionNote: Re-released for DXP Platform.; Publisher: Altium Limited
R27 = RES-4.7K-0001: RES SMD 4.7K OHM 1% 1/16W 0402; Manufacturer: YAGEO; Assembled?: no; Manufacturer Part Number: RC0402FR-074K7P; Package Size: 0402
R28 = RES-120-0002: 120 Ohms ±1% 0.5W, 1/2W Chip Resistor 1206 (3216 Metric) Thick Film; Tolerance: 1%; Package Size: 1206
R29 R30 = RES-4.7K-0002: RES SMD 4.7K OHM 1% 1/10W 0603; Manufacturer: YAGEO; Assembled?: no; Manufacturer Part Number: AF0603FR-074K7L; Package Size: 0603
TP10 TP11 = TEST-POINT-0001: as TP1 on sheet Motor_12V_Buck
U2 = IC-CAN-TRANSCEIVER-0002: 1/1 Transceiver CANbus 8-VSON (3x3); Manufacturer: Texas Instrument; CAN Capability: FD-CAN; Manufacturer Part Number: TCAN1042HGDRBTQ1
U3 = IC-LDO-3.3V-0002: Linear Voltage Regulator IC Positive Fixed 1 Output 500mA SOT-223-4; Vin: 25V; Vout: 3.3V; Package: SOT-223-4
U4 = IC-LDO-5V-0003: Linear Voltage Regulator IC Positive Fixed 1 Output 500mA SOT-223-4; Manufacturer: Texas Instruments; Assembled?: no; Manufacturer Part Number: UA78M05IDCYR; Package Size: SOT223-4; Type: Low dropout (LDO)
U5 = IC-STM32G431CBU6: 128KB 1.71V~3.6V ARM-MSeries 32KB 170MHz FLASH 42 UFQFPN-48(7x7) Microcontroller Units (MCUs/MPUs/SOCs) ROHS; Assembled?: no; Manufacturer Part Number: STM32G431CBU6; Package: UFQFPN-48

## Nets that join several sheets
5V: Connectors (X3.P$4), MCU_CAN (6 pins)
12V_MOTOR_MAIN: Motor_12V_Buck (13 pins), HBridge_Design (10 pins), MCU_CAN (C50.1 C52.1 U3.1 U4.1)
GND: Connectors (15 pins), Motor_12V_Buck (35 pins), HBridge_Top_Level (8 pins), HBridge_Design (14 pins), MCU_CAN (21 pins)
VBAT: Connectors (D17.1 R31.1 X1.P$2), Motor_12V_Buck (13 pins)
VBAT_MCU: Connectors (X4.P$1), HBridge_Top_Level (C42.1 C43.2 I1.8 I2.8), MCU_CAN (19 pins)
CAN_N: Connectors (X6.P$3 X8.P$3), MCU_CAN (R28.1 U2.6)
CAN_P: Connectors (X6.P$1 X8.P$1), MCU_CAN (R28.2 U2.7)
DIR_1_In: HBridge_Top_Level (I2.5 R16.1), HBridge_Design (I3.5 I4.6)
DIR_2_In: HBridge_Top_Level (I1.5 R15.1), HBridge_Design (I3.6 I4.5)
I2C1_SCL: Connectors (X4.P$5), MCU_CAN (R30.1 U5.46)
I2C1_SDA: Connectors (X4.P$2), MCU_CAN (R29.1 U5.47)
LIMIT_0_A: Connectors (X7.P$5), MCU_CAN (U5.2)
LIMIT_0_B: Connectors (X7.P$6), MCU_CAN (U5.3)
LIMIT_0_C: Connectors (X7.P$7), MCU_CAN (U5.4)
LIMIT_0_D: Connectors (X7.P$8), MCU_CAN (U5.5)
M+: Connectors (X5.P$1), HBridge_Design (7 pins)
M-: Connectors (X5.P$2), HBridge_Design (7 pins)
MOTOR_0_DIR: HBridge_Top_Level (I1.6 I2.6), MCU_CAN (U5.28)
MOTOR_0_PWM: HBridge_Top_Level (I1.1 I2.2), MCU_CAN (U5.27)
QUAD_0_A: Connectors (X3.P$1), MCU_CAN (U5.44)
QUAD_0_B: Connectors (X3.P$3), MCU_CAN (U5.45)